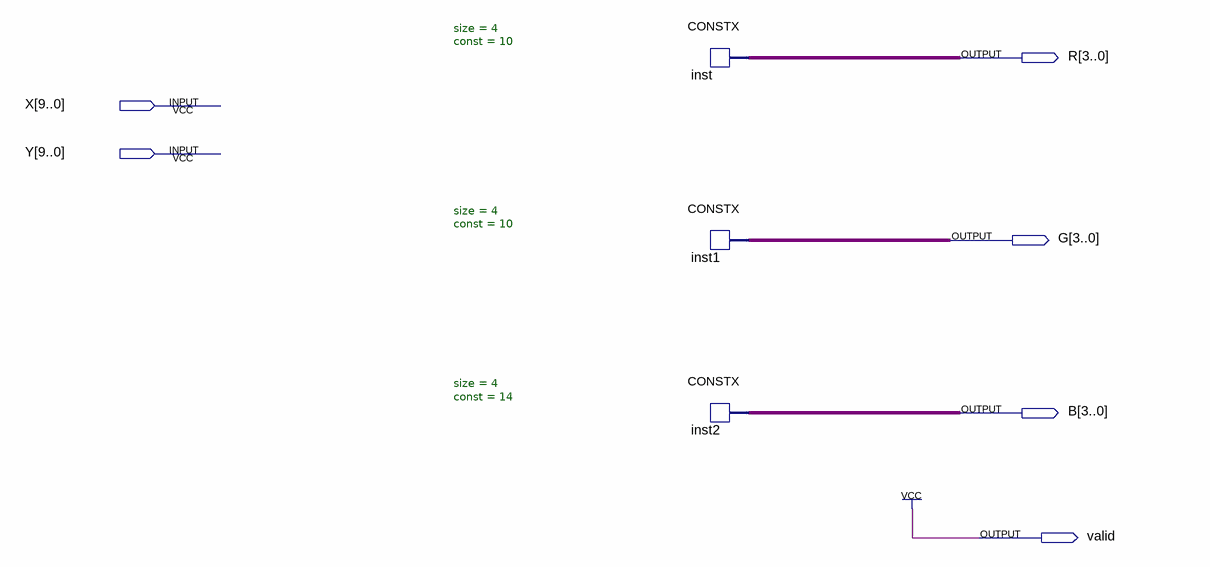
[diagram p0: schematic sheet]
// Quartus schematic Layer0.bdf as structural Verilog: 3 symbols, 6 pins
module Layer0 (
  input  [9:0] X,
  input  [9:0] Y,
  output [3:0] R,
  output [3:0] G,
  output [3:0] B,
  output valid
);

  CONSTX #(.size(4), .\const (10)) inst (.data(R));
  CONSTX #(.size(4), .\const (10)) inst1 (.data(G));
  CONSTX #(.size(4), .\const (14)) inst2 (.data(B));

  assign valid = 1'b1;
endmodule
